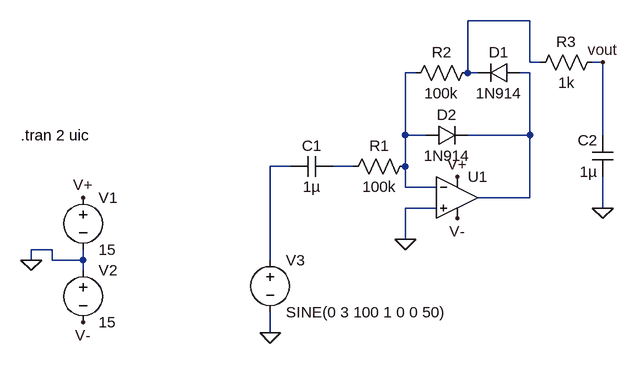
[diagram p0: schematic peak-detector.asc]
peak-detector.asc, the LTspice schematic file:
Version 4
SHEET 1 924 680
WIRE 768 -176 672 -176
WIRE 768 -112 768 -176
WIRE 784 -112 768 -112
WIRE 880 -112 864 -112
WIRE 592 -96 576 -96
WIRE 672 -96 672 -176
WIRE 688 -96 672 -96
WIRE 768 -96 752 -96
WIRE 576 0 576 -96
WIRE 608 0 576 0
WIRE 768 0 768 -96
WIRE 768 0 672 0
WIRE 880 0 880 -112
WIRE 400 48 368 48
WIRE 496 48 464 48
WIRE 576 48 576 0
WIRE 576 80 576 48
WIRE 624 80 576 80
WIRE 768 96 768 0
WIRE 768 96 688 96
WIRE 624 112 576 112
WIRE 880 112 880 64
WIRE 576 160 576 112
WIRE 32 176 0 176
WIRE 0 192 0 176
WIRE 32 192 32 176
WIRE 80 192 80 176
WIRE 80 192 32 192
WIRE 368 192 368 48
WIRE 80 208 80 192
WIRE 368 304 368 272
FLAG 0 192 0
FLAG 368 304 0
FLAG 80 96 V+
FLAG 656 64 V+
FLAG 80 288 V-
FLAG 656 128 V-
FLAG 576 160 0
FLAG 880 112 0
FLAG 880 -112 vout
SYMBOL voltage 80 80 R0
WINDOW 123 0 0 Left 2
WINDOW 39 0 0 Left 2
SYMATTR InstName V1
SYMATTR Value 15
SYMBOL voltage 80 192 R0
WINDOW 123 0 0 Left 2
WINDOW 39 0 0 Left 2
SYMATTR InstName V2
SYMATTR Value 15
SYMBOL voltage 368 176 R0
WINDOW 123 0 0 Left 2
WINDOW 39 0 0 Left 2
SYMATTR InstName V3
SYMATTR Value SINE(0 3 100 1 0 0 50)
SYMBOL Opamps\\UniversalOpamp2 656 96 R0
SYMATTR InstName U1
SYMBOL cap 464 32 R90
WINDOW 0 0 32 VBottom 2
WINDOW 3 32 32 VTop 2
SYMATTR InstName C1
SYMATTR Value 1µ
SYMBOL cap 896 64 R180
WINDOW 0 24 56 Left 2
WINDOW 3 24 8 Left 2
SYMATTR InstName C2
SYMATTR Value 1µ
SYMBOL res 592 32 R90
WINDOW 0 0 56 VBottom 2
WINDOW 3 32 56 VTop 2
SYMATTR InstName R1
SYMATTR Value 100k
SYMBOL res 688 -112 R90
WINDOW 0 0 56 VBottom 2
WINDOW 3 32 56 VTop 2
SYMATTR InstName R2
SYMATTR Value 100k
SYMBOL res 880 -128 R90
WINDOW 0 0 56 VBottom 2
WINDOW 3 32 56 VTop 2
SYMATTR InstName R3
SYMATTR Value 1k
SYMBOL diode 752 -112 R90
WINDOW 0 0 32 VBottom 2
WINDOW 3 32 32 VTop 2
SYMATTR InstName D1
SYMATTR Value 1N914
SYMBOL diode 608 16 R270
WINDOW 0 32 32 VTop 2
WINDOW 3 0 32 VBottom 2
SYMATTR InstName D2
SYMATTR Value 1N914
TEXT -16 0 Left 2 !.tran 2 uic

The netlist it stands for:
* peak-detector.asc
V1 V+ 0 15
V2 0 V- 15
V3 N004 0 SINE(0 3 100 1 0 0 50)
XU1 0 N002 V+ V- N003 level.2 Avol=1Meg GBW=10Meg Slew=10Meg ilimit=25m rail=0 Vos=0 phimargin=45 en=0 enk=0 in=0 ink=0 Rin=500Meg  ; pins IN+ IN- V+ V- OUT
C1 N005 N004 1µ
C2 0 vout 1µ
R1 N002 N005 100k
R2 N001 N002 100k
R3 vout N001 1k
D1 N003 N001 1N914
D2 N002 N003 1N914
.model D D
.lib standard.dio
.tran 2 uic
.lib UniversalOpamps2.sub
.backanno
.end